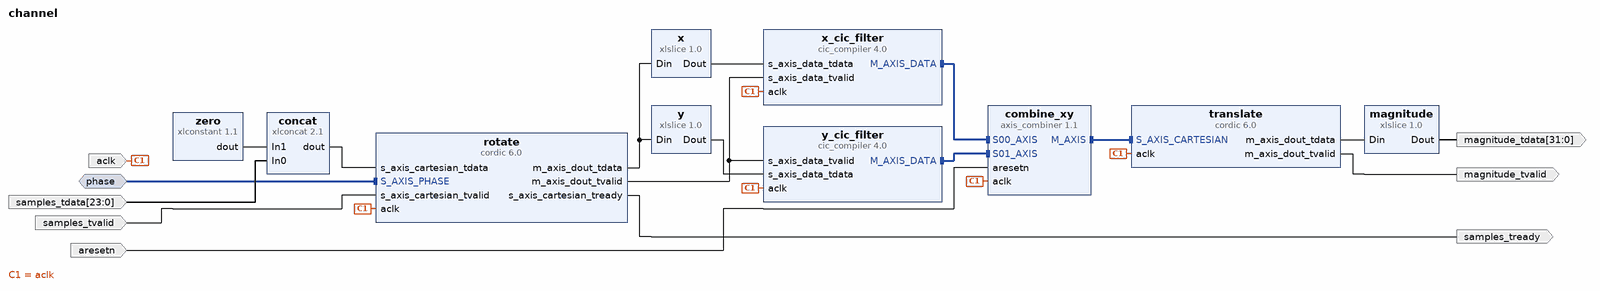
[diagram p0: block diagram of the top level]
# Vivado block design channel, xc7a35ticsg324-1L, Vivado 2019.1
create_bd_design channel

create_bd_intf_port -mode Slave -vlnv xilinx.com:interface:axis_rtl:1.0 phase
set_property -dict [list \
  CONFIG.HAS_TKEEP 0 \
  CONFIG.HAS_TLAST 0 \
  CONFIG.HAS_TREADY 1 \
  CONFIG.HAS_TSTRB 0 \
  CONFIG.LAYERED_METADATA undef \
  CONFIG.TDATA_NUM_BYTES 3 \
  CONFIG.TDEST_WIDTH 0 \
  CONFIG.TID_WIDTH 0 \
  CONFIG.TUSER_WIDTH 0 \
] [get_bd_intf_ports phase]
create_bd_port -dir I -type clk aclk
set_property -dict {CONFIG.FREQ_HZ 100000000} [get_bd_ports aclk]
create_bd_port -dir I -type data samples_tvalid
create_bd_port -dir O samples_tready
create_bd_port -dir I -from 23 -to 0 -type data samples_tdata
create_bd_port -dir I -type rst aresetn
create_bd_port -dir O -type data magnitude_tvalid
create_bd_port -dir O -from 31 -to 0 magnitude_tdata

create_bd_cell -type ip -vlnv xilinx.com:ip:xlconcat:2.1 concat
set_property -dict {CONFIG.dout_width 48} [get_bd_cells concat]
create_bd_cell -type ip -vlnv xilinx.com:ip:xlslice:1.0 magnitude
set_property -dict {CONFIG.DIN_FROM 31 CONFIG.DIN_TO 0 CONFIG.DIN_WIDTH 64 CONFIG.DOUT_WIDTH 32} [get_bd_cells magnitude]
create_bd_cell -type ip -vlnv xilinx.com:ip:xlslice:1.0 x
set_property -dict {CONFIG.DIN_FROM 23 CONFIG.DIN_TO 0 CONFIG.DIN_WIDTH 48 CONFIG.DOUT_WIDTH 24} [get_bd_cells x]
create_bd_cell -type ip -vlnv xilinx.com:ip:xlslice:1.0 y
set_property -dict {CONFIG.DIN_FROM 47 CONFIG.DIN_TO 24 CONFIG.DIN_WIDTH 48 CONFIG.DOUT_WIDTH 1} [get_bd_cells y]
create_bd_cell -type ip -vlnv xilinx.com:ip:xlconstant:1.1 zero
set_property -dict {CONFIG.CONST_VAL 0 CONFIG.CONST_WIDTH 24} [get_bd_cells zero]
create_bd_cell -type ip -vlnv xilinx.com:ip:axis_combiner:1.1 combine_xy
set_property -dict {CONFIG.TDATA_NUM_BYTES 6} [get_bd_cells combine_xy]
create_bd_cell -type ip -vlnv xilinx.com:ip:cordic:6.0 rotate
set_property -dict [list \
  CONFIG.Architectural_Configuration Word_Serial \
  CONFIG.Compensation_Scaling Embedded_Multiplier \
  CONFIG.Input_Width 17 \
  CONFIG.Output_Width 24 \
  CONFIG.Phase_Format Scaled_Radians \
  CONFIG.Pipelining_Mode Maximum \
  CONFIG.Round_Mode Round_Pos_Neg_Inf \
] [get_bd_cells rotate]
create_bd_cell -type ip -vlnv xilinx.com:ip:cordic:6.0 translate
set_property -dict [list \
  CONFIG.Architectural_Configuration Word_Serial \
  CONFIG.Compensation_Scaling No_Scale_Compensation \
  CONFIG.Data_Format SignedFraction \
  CONFIG.Functional_Selection Translate \
  CONFIG.Input_Width 48 \
  CONFIG.Output_Width 32 \
  CONFIG.Phase_Format Scaled_Radians \
  CONFIG.Pipelining_Mode Maximum \
  CONFIG.Round_Mode Round_Pos_Neg_Inf \
] [get_bd_cells translate]
create_bd_cell -type ip -vlnv xilinx.com:ip:cic_compiler:4.0 x_cic_filter
set_property -dict [list \
  CONFIG.Clock_Frequency 100 \
  CONFIG.Differential_Delay 1 \
  CONFIG.Filter_Type Decimation \
  CONFIG.Fixed_Or_Initial_Rate 1024 \
  CONFIG.Input_Data_Width 24 \
  CONFIG.Input_Sample_Frequency 1 \
  CONFIG.Maximum_Rate 1024 \
  CONFIG.Minimum_Rate 1024 \
  CONFIG.Number_Of_Channels 1 \
  CONFIG.Output_Data_Width 48 \
  CONFIG.Quantization Truncation \
  CONFIG.SamplePeriod 1 \
  CONFIG.Use_Xtreme_DSP_Slice false \
] [get_bd_cells x_cic_filter]
create_bd_cell -type ip -vlnv xilinx.com:ip:cic_compiler:4.0 y_cic_filter
set_property -dict [list \
  CONFIG.Clock_Frequency 100 \
  CONFIG.Differential_Delay 1 \
  CONFIG.Filter_Type Decimation \
  CONFIG.Fixed_Or_Initial_Rate 1024 \
  CONFIG.Input_Data_Width 24 \
  CONFIG.Input_Sample_Frequency 1 \
  CONFIG.Maximum_Rate 1024 \
  CONFIG.Minimum_Rate 1024 \
  CONFIG.Number_Of_Channels 1 \
  CONFIG.Output_Data_Width 48 \
  CONFIG.Quantization Truncation \
  CONFIG.SamplePeriod 1 \
  CONFIG.Use_Xtreme_DSP_Slice false \
] [get_bd_cells y_cic_filter]

# ---- connections ----

connect_bd_intf_net [get_bd_intf_pins combine_xy/S00_AXIS] [get_bd_intf_pins x_cic_filter/M_AXIS_DATA]
connect_bd_intf_net [get_bd_intf_pins translate/S_AXIS_CARTESIAN] [get_bd_intf_pins combine_xy/M_AXIS]
connect_bd_intf_net [get_bd_intf_ports phase] [get_bd_intf_pins rotate/S_AXIS_PHASE]
connect_bd_intf_net [get_bd_intf_pins combine_xy/S01_AXIS] [get_bd_intf_pins y_cic_filter/M_AXIS_DATA]
connect_bd_net [get_bd_ports aclk] \
  [get_bd_pins combine_xy/aclk] [get_bd_pins rotate/aclk] [get_bd_pins translate/aclk] [get_bd_pins x_cic_filter/aclk] \
  [get_bd_pins y_cic_filter/aclk]
connect_bd_net [get_bd_ports samples_tvalid] [get_bd_pins rotate/s_axis_cartesian_tvalid]
connect_bd_net -net cordic_0_s_axis_cartesian_tready [get_bd_pins rotate/s_axis_cartesian_tready] [get_bd_ports samples_tready]
connect_bd_net [get_bd_ports samples_tdata] [get_bd_pins concat/In0]
connect_bd_net -net xlconstant_0_dout [get_bd_pins zero/dout] [get_bd_pins concat/In1]
connect_bd_net -net xlconcat_0_dout [get_bd_pins concat/dout] [get_bd_pins rotate/s_axis_cartesian_tdata]
connect_bd_net -net multiply_m_axis_dout_tdata [get_bd_pins rotate/m_axis_dout_tdata] [get_bd_pins x/Din] [get_bd_pins y/Din]
connect_bd_net [get_bd_pins x/Dout] [get_bd_pins x_cic_filter/s_axis_data_tdata]
connect_bd_net -net multiply_m_axis_dout_tvalid [get_bd_pins rotate/m_axis_dout_tvalid] \
  [get_bd_pins x_cic_filter/s_axis_data_tvalid] [get_bd_pins y_cic_filter/s_axis_data_tvalid]
connect_bd_net [get_bd_pins y/Dout] [get_bd_pins y_cic_filter/s_axis_data_tdata]
connect_bd_net [get_bd_ports aresetn] [get_bd_pins combine_xy/aresetn]
connect_bd_net [get_bd_pins translate/m_axis_dout_tdata] [get_bd_pins magnitude/Din]
connect_bd_net [get_bd_pins translate/m_axis_dout_tvalid] [get_bd_ports magnitude_tvalid]
connect_bd_net [get_bd_pins magnitude/Dout] [get_bd_ports magnitude_tdata]

validate_bd_design
save_bd_design
